# EAGLE schematic potinho (EAGLE 6.1)
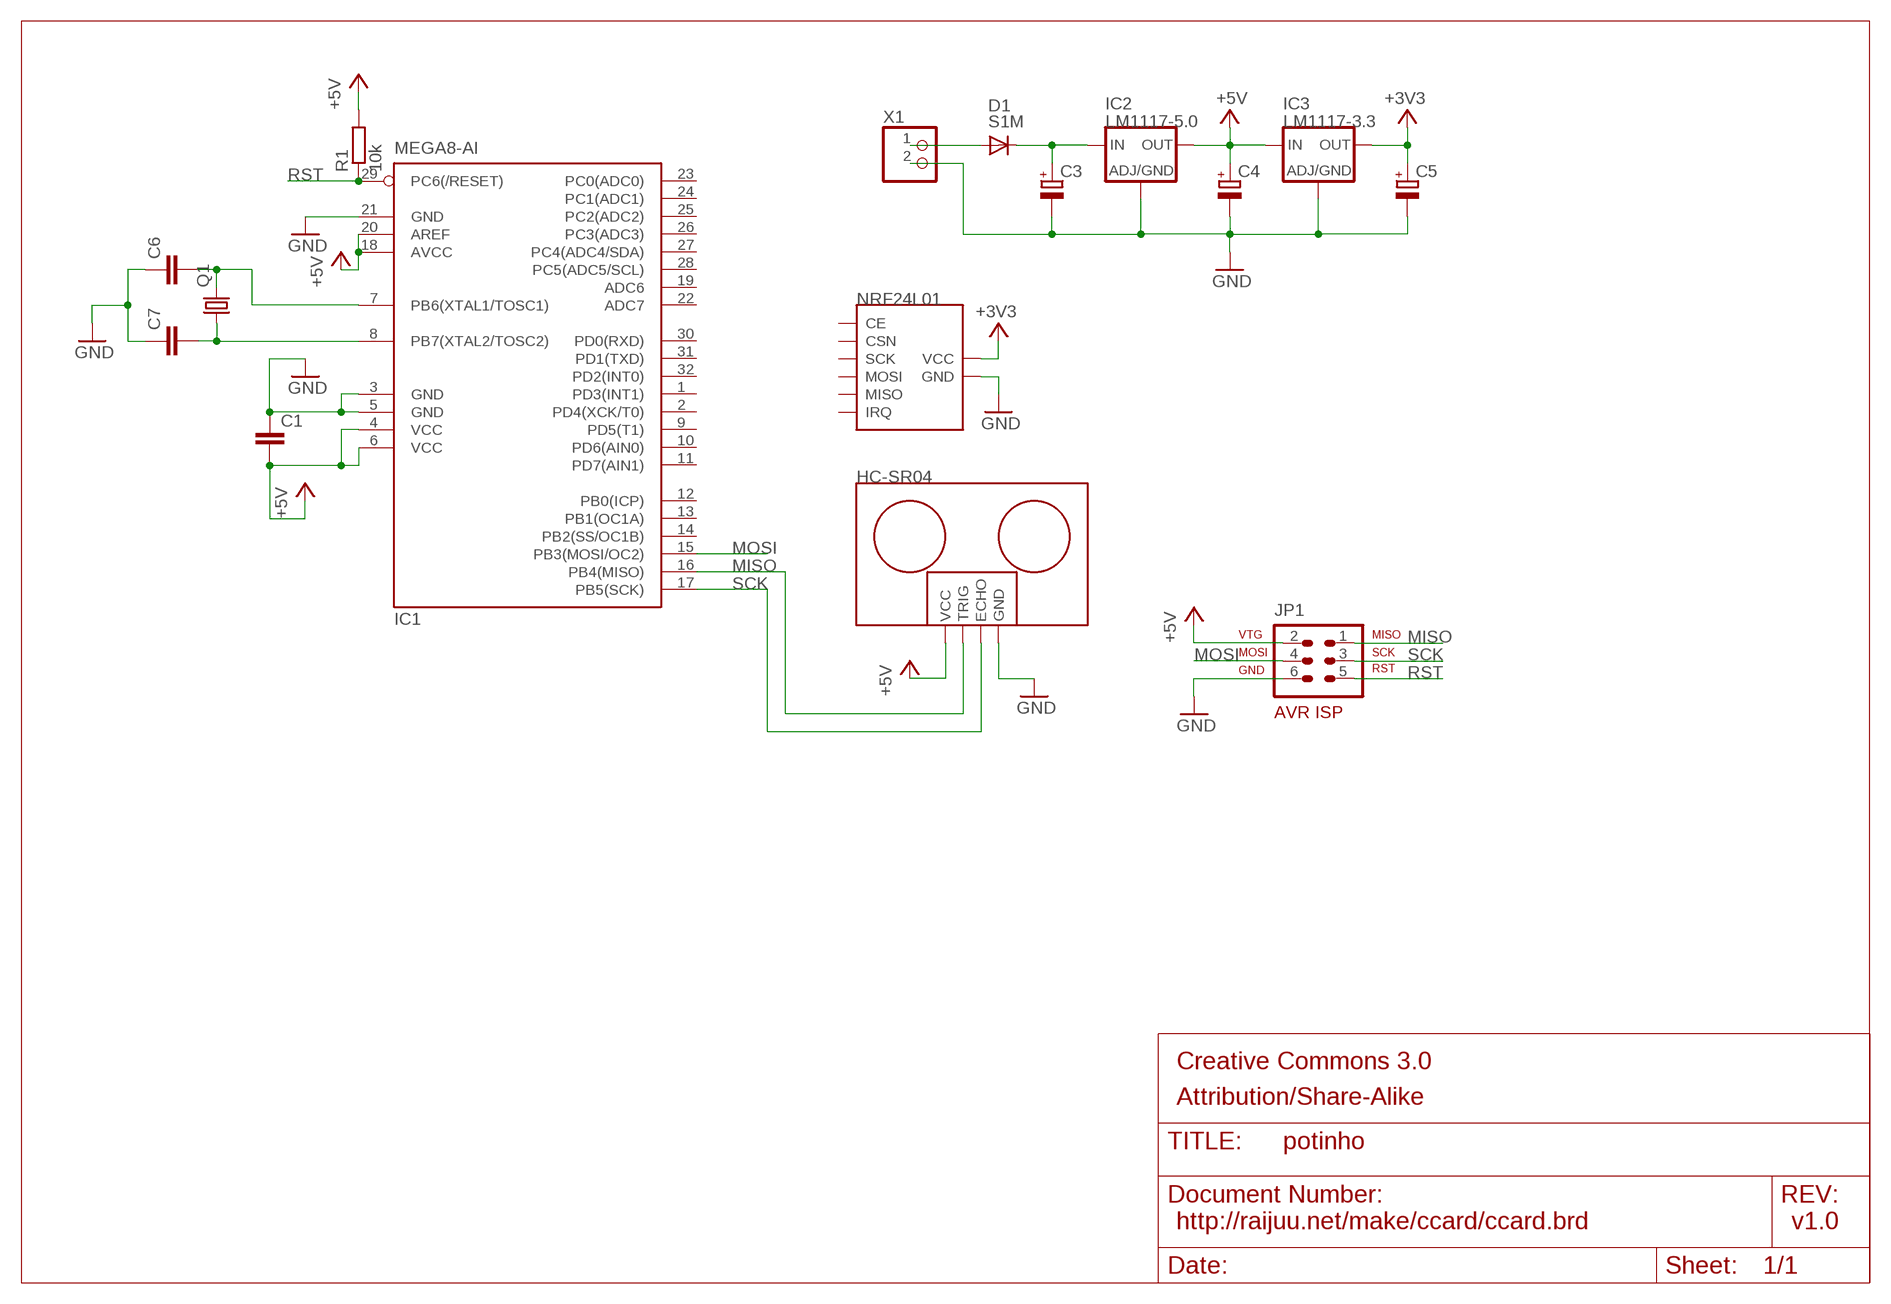
[diagram p0: schematic, sheet 1]

## Parts
C1  C-EUC0805K  [C0805K]
C3  CPOL-EUPD  [PANASONIC_D]
C4  CPOL-EUPD  [PANASONIC_D]
C5  CPOL-EUPD  [PANASONIC_D]
C6  C-EUC0805K  [C0805K]
C7  C-EUC0805K  [C0805K]
D1  S1M  [DO-214AC]
IC1  MEGA8-AI  [TQFP32-08]
IC2  LM1117-5.0  LM1117S  [SOT223]
IC3  LM1117-3.3  LM1117S  [SOT223]
IC4  NRF24L01  NRF24L01-MODULE  [NRF24L01-MODULE]
IC31  HC-SR04  [1X04]
JP1  AVR-ISP-6  [AVR-ISP-6]
Q1  CRYSTALHC49UP  [HC49UP]
R1  10k  R-EU_R0805  [R0805]
X1  W237-102  [W237-102]

## Nets
+3V3: C5.+ IC3.2(OUT) IC3.4(OUT) IC4.2(VCC)
+5V: C1.2 C4.+ IC1.4(VCC) IC1.6(VCC) IC1.18(AVCC) IC1.20(AREF) IC2.2(OUT) IC2.4(OUT) IC3.3(IN) IC31.1(VCC) JP1.2(VTG) R1.2
GND: C1.1 C3.- C4.- C5.- C6.1 C7.1 IC1.3(GND) IC1.5(GND) IC1.21(GND) IC2.1(ADJ) IC3.1(ADJ) IC4.1(GND) IC31.4(GND) JP1.6(GND) X1.2
MISO: IC1.16(PB4(MISO)) IC31.2(TRIG) JP1.1(MISO)
MOSI: IC1.15(PB3(MOSI/OC2)) JP1.4(MOSI)
N$1: D1.A X1.1
N$3: C3.+ D1.C IC2.3(IN)
N$5: C7.2 IC1.8(PB7(XTAL2/TOSC2)) Q1.1
N$6: C6.2 IC1.7(PB6(XTAL1/TOSC1)) Q1.2
RST: IC1.29(PC6(/RESET)) JP1.5(RST) R1.1
SCK: IC1.17(PB5(SCK)) IC31.3(ECHO) JP1.3(SCK)
Unconnected: IC1.1(PD3(INT1)) IC1.2(PD4(XCK/T0)) IC1.9(PD5(T1)) IC1.10(PD6(AIN0)) IC1.11(PD7(AIN1)) IC1.12(PB0(ICP)) IC1.13(PB1(OC1A)) IC1.14(PB2(SS/OC1B)) IC1.19(ADC6) IC1.22(ADC7) IC1.23(PC0(ADC0)) IC1.24(PC1(ADC1)) IC1.25(PC2(ADC2)) IC1.26(PC3(ADC3)) IC1.27(PC4(ADC4/SDA)) IC1.28(PC5(ADC5/SCL)) IC1.30(PD0(RXD)) IC1.31(PD1(TXD)) IC1.32(PD2(INT0)) IC4.3(CE) IC4.4(CSN) IC4.5(SCK) IC4.6(MOSI) IC4.7(MISO) IC4.8(IRQ)

## Notes on the sheet
- Creative Commons 3.0
- Attribution/Share-Alike
- http://raijuu.net/make/ccard/ccard.brd | v1.0

## Library data of the parts
C1 C6 C7 = potinho:C-EU: CAPACITOR, European symbol
C3-C5 = potinho:CPOL-EU: POLARIZED CAPACITOR, European symbol
D1 = potinho:S1M
IC1 = potinho:MEGA8: MICROCONTROLLER 8 Kbytes FLASH, 1 kbytes SRAM, 512 bytes EEPROM, USART, 6-channel 10 bit ADC, 2-channel 8 bit ADC Pin compatible with Atmega48, ATMega88, ATMega168 Source: avr.lbr; MPN: ATMEGA8-16AU; OC_FARNELL: 9171371; OC_NEWARK: 73M8863
IC2 IC3 = potinho:LM1117: Low drop fixed and adjustable positive voltage regulators 1 A Source: http://www.st.com/stonline/products/literature/ds/7194/ld1117axx.pdf
IC4 = potinho:NRF24L01-MODULE
IC31 = potinho:HC-SR04
JP1 = potinho:AVR-ISP-6: AVR ISP-6 Serial Programming Header
Q1 = potinho:CRYSTAL: CRYSTAL
R1 = potinho:R-EU_: RESISTOR, European symbol
X1 = potinho:W237-102: WAGO SCREW CLAMP